# EAGLE schematic untitled (EAGLE 6.2)
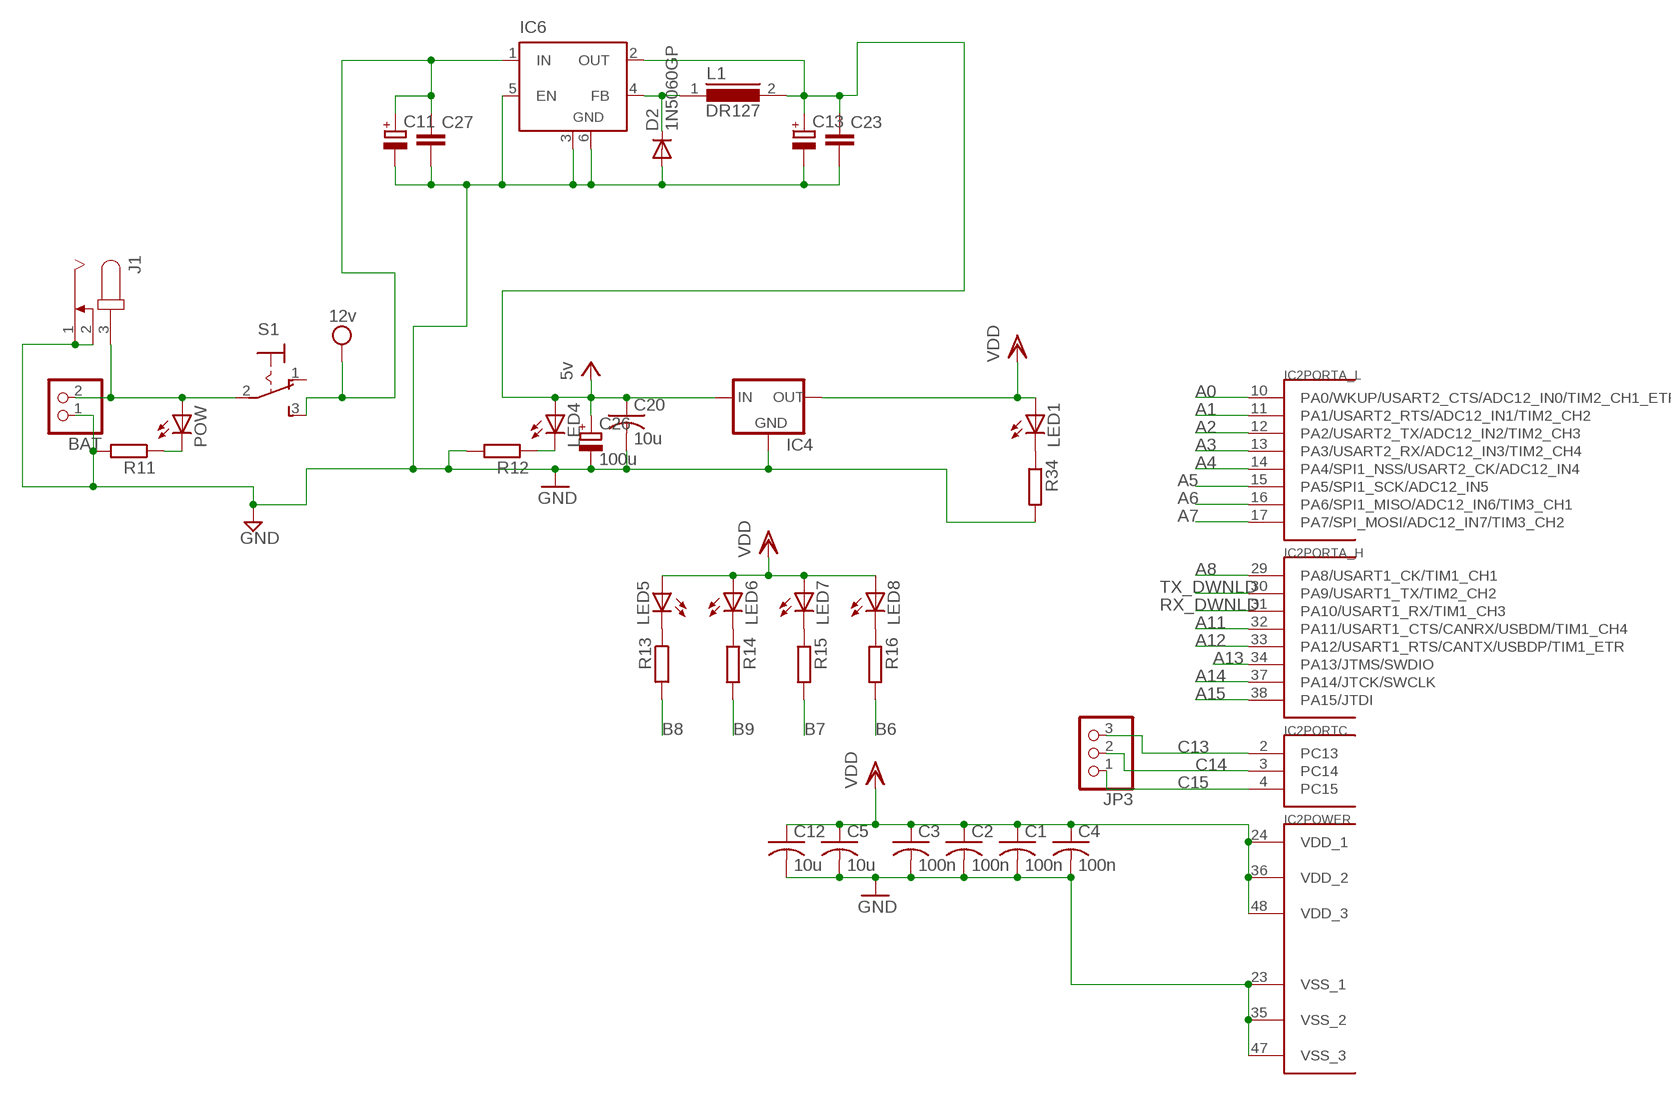
[diagram p0: schematic, sheet 1, part 1 of 2]
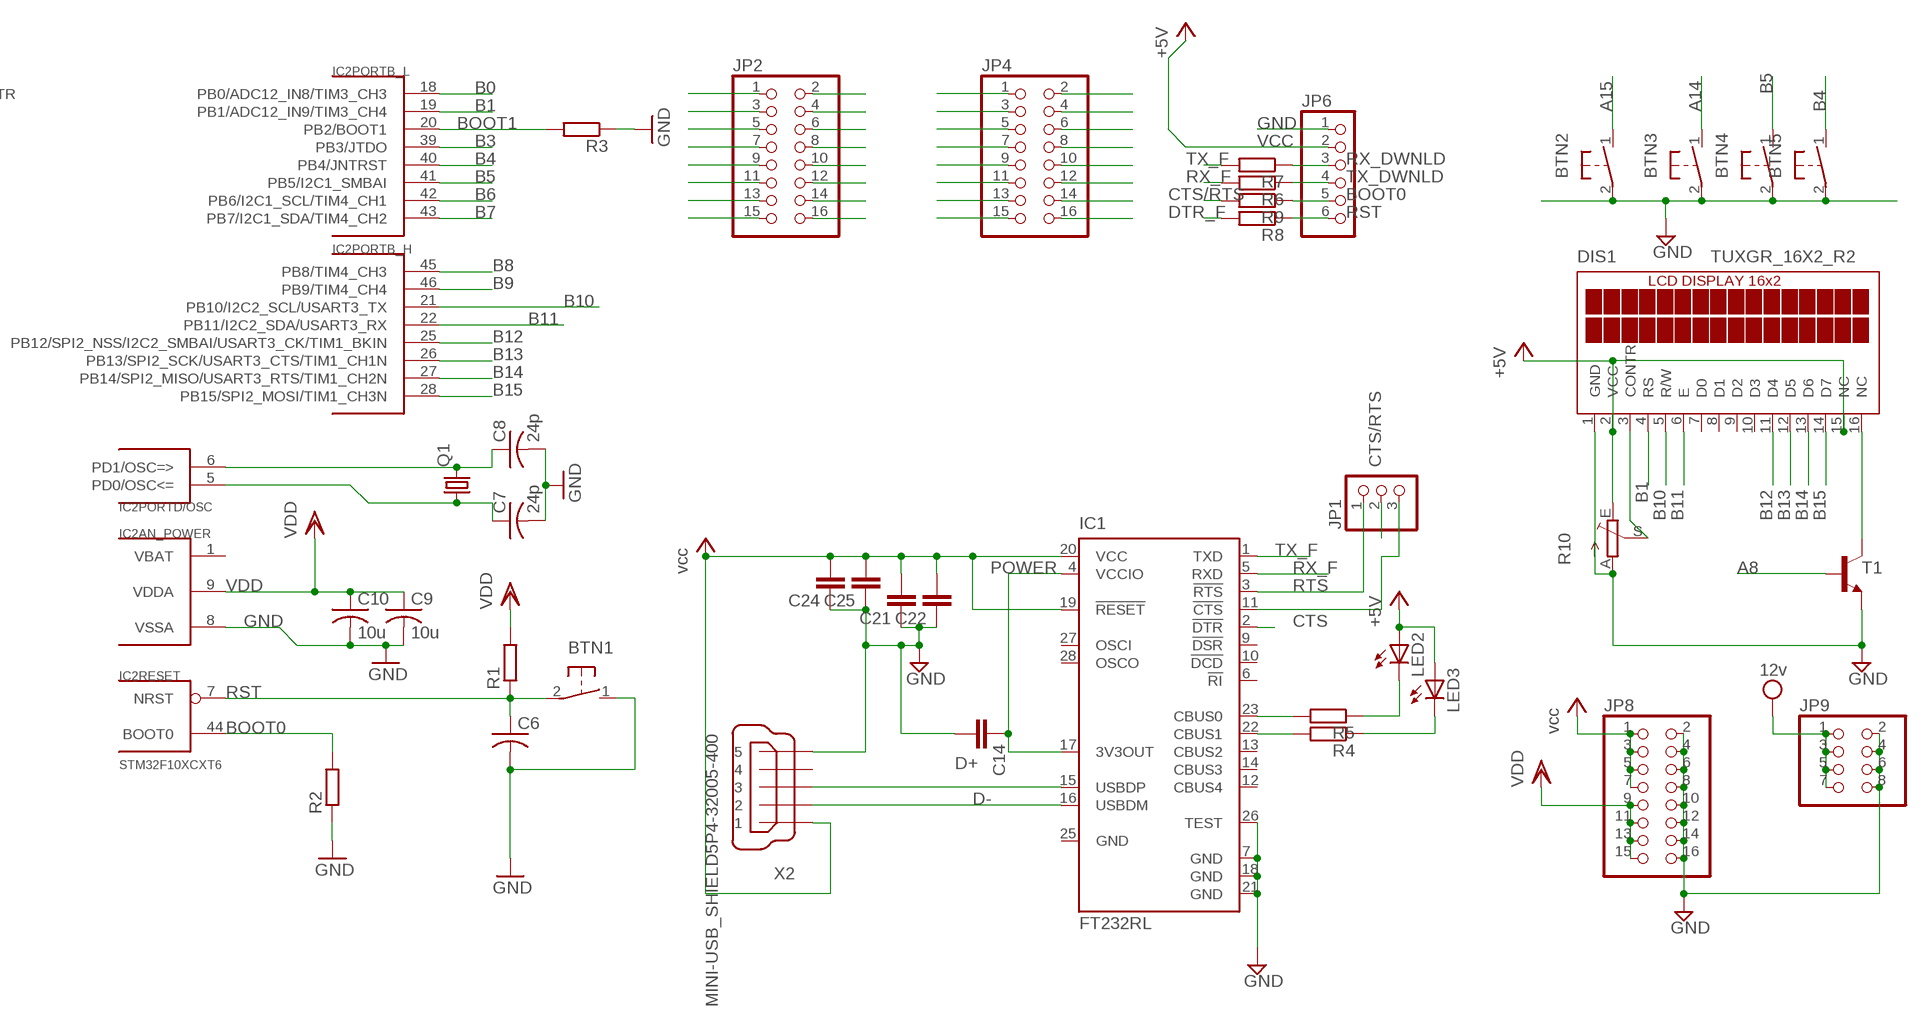
[diagram p1: schematic, sheet 1, part 2 of 2]

## Parts
BAT  PINHD-1X2  [1X02]
BTN1  PUSHBTN  [PUSHBUTTON]
BTN2  PUSHBTN  [PUSHBUTTON]
BTN3  PUSHBTN  [PUSHBUTTON]
BTN4  PUSHBTN  [PUSHBUTTON]
BTN5  PUSHBTN  [PUSHBUTTON]
C1  100n  C-USC0805  [C0805]
C2  100n  C-USC0805  [C0805]
C3  100n  C-USC0805  [C0805]
C4  100n  C-USC0805  [C0805]
C5  10u  C-USC0805  [C0805]
C6  C-USC0805  [C0805]
C7  24p  C-USC0805  [C0805]
C8  24p  C-USC0805  [C0805]
C9  10u  C-USC0805  [C0805]
C10  10u  C-USC0805  [C0805]
C11  CPOL-EU153CLV-1012  [153CLV-1012]
C12  10u  C-USC0805  [C0805]
C13  CPOL-EU153CLV-1012  [153CLV-1012]
C14  C-EUC0805  [C0805]
C20  10u  C-USC0805  [C0805]
C21  C-EUC0805  [C0805]
C22  C-EUC0805  [C0805]
C23  C-EUC0805  [C0805]
C24  C-EUC0805  [C0805]
C25  C-EUC0805  [C0805]
C26  100u  CPOL-EU153CLV-1012  [153CLV-1012]
C27  C-EUC0805  [C0805]
D2  1N5060GP  [DO15-12]
DIS1  TUXGR_16X2_R2  [TUXGR_16X2_R2]
IC1  FT232RL  [SSOP28]
IC2  STM32F10XCXT6  [TQFP48]
IC4  LM1117  [SOT223]
IC6  LM2596S  [TO263-5]
J1  JACK-PLUG1  [SPC4078]
JP1  PINHD-1X3  [1X03]
JP2  PINHD-2X8  [2X08]
JP3  PINHD-1X3  [1X03]
JP4  PINHD-2X8  [2X08]
JP6  PINHD-1X6  [1X06]
JP8  PINHD-2X8  [2X08]
JP9  PINHD-2X4  [2X04]
L1  DR127  [DR127]
LED1  LEDSMT1206  [1206]
LED2  LEDSMT1206  [1206]
LED3  LEDSMT1206  [1206]
LED4  LEDSMT1206  [1206]
LED5  LEDSMT1206  [1206]
LED6  LEDSMT1206  [1206]
LED7  LEDSMT1206  [1206]
LED8  LEDSMT1206  [1206]
POW  LEDSMT1206  [1206]
Q1  CRYSTALHC49U-V  [HC49U-V]
R1  R-EU_M0805  [M0805]
R2  R-EU_M0805  [M0805]
R3  R-EU_M0805  [M0805]
R4  R-EU_R0805  [R0805]
R5  R-EU_R0805  [R0805]
R6  R-EU_R0805  [R0805]
R7  R-EU_R0805  [R0805]
R8  R-EU_R0805  [R0805]
R9  R-EU_R0805  [R0805]
R10  TRIM_EU-CA6V  [CA6V]
R11  R-EU_M0805  [M0805]
R12  R-EU_M0805  [M0805]
R13  R-EU_M0805  [M0805]
R14  R-EU_M0805  [M0805]
R15  R-EU_M0805  [M0805]
R16  R-EU_M0805  [M0805]
R34  R-EU_M0805  [M0805]
S1  320-916  [320-916]
T1  BC818-NPN-SOT23-BEC  [SOT23-BEC]
X2  MINI-USB_SHIELD5P4-32005-400  [32005-400]

## Nets
12V: C11.+ C27.1 IC6.1(IN) JP9.1 JP9.3 JP9.5 JP9.7 S1.3(S) ; supply symbol labelled 12v
A0: IC2.10(PORTA_L:PA0/WKUP/USART2_CTS/ADC12_IN0/TIM2_CH1_ETR)
A1: IC2.11(PORTA_L:PA1/USART2_RTS/ADC12_IN1/TIM2_CH2)
A2: IC2.12(PORTA_L:PA2/USART2_TX/ADC12_IN2/TIM2_CH3)
A3: IC2.13(PORTA_L:PA3/USART2_RX/ADC12_IN3/TIM2_CH4)
A4: IC2.14(PORTA_L:PA4/SPI1_NSS/USART2_CK/ADC12_IN4)
A5: IC2.15(PORTA_L:PA5/SPI1_SCK/ADC12_IN5)
A6: IC2.16(PORTA_L:PA6/SPI1_MISO/ADC12_IN6/TIM3_CH1)
A7: IC2.17(PORTA_L:PA7/SPI_MOSI/ADC12_IN7/TIM3_CH2)
A8: IC2.29(PORTA_H:PA8/USART1_CK/TIM1_CH1) T1.B
A11: IC2.32(PORTA_H:PA11/USART1_CTS/CANRX/USBDM/TIM1_CH4)
A12: IC2.33(PORTA_H:PA12/USART1_RTS/CANTX/USBDP/TIM1_ETR)
A13: IC2.34(PORTA_H:PA13/JTMS/SWDIO)
A14: BTN3.1 IC2.37(PORTA_H:PA14/JTCK/SWCLK)
A15: BTN2.1 IC2.38(PORTA_H:PA15/JTDI)
B0: IC2.18(PORTB_L:PB0/ADC12_IN8/TIM3_CH3)
B1: DIS1.4(RS) IC2.19(PORTB_L:PB1/ADC12_IN9/TIM3_CH4)
B3: IC2.39(PORTB_L:PB3/JTDO)
B4: BTN5.1 IC2.40(PORTB_L:PB4/JNTRST)
B5: BTN4.1 IC2.41(PORTB_L:PB5/I2C1_SMBAI)
B6: IC2.42(PORTB_L:PB6/I2C1_SCL/TIM4_CH1) R16.2
B7: IC2.43(PORTB_L:PB7/I2C1_SDA/TIM4_CH2) R15.2
B8: IC2.45(PORTB_H:PB8/TIM4_CH3) R13.2
B9: IC2.46(PORTB_H:PB9/TIM4_CH4) R14.2
B10: DIS1.5(R/W) IC2.21(PORTB_H:PB10/I2C2_SCL/USART3_TX)
B11: DIS1.6(E) IC2.22(PORTB_H:PB11/I2C2_SDA/USART3_RX)
B12: DIS1.11(D4) IC2.25(PORTB_H:PB12/SPI2_NSS/I2C2_SMBAI/USART3_CK/TIM1_BKIN)
B13: DIS1.12(D5) IC2.26(PORTB_H:PB13/SPI2_SCK/USART3_CTS/TIM1_CH1N)
B14: DIS1.13(D6) IC2.27(PORTB_H:PB14/SPI2_MISO/USART3_RTS/TIM1_CH2N)
B15: DIS1.14(D7) IC2.28(PORTB_H:PB15/SPI2_MOSI/TIM1_CH3N)
BOOT0: IC2.44(RESET:BOOT0) JP6.5 R2.2 R9.1
BOOT1: IC2.20(PORTB_L:PB2/BOOT1) R3.2
C13: IC2.2(PORTC:PC13) JP3.3
C14: IC2.3(PORTC:PC14) JP3.2
C15: IC2.4(PORTC:PC15) JP3.1
CTS: IC1.11(!CTS) JP1.3
CTS/RTS: JP1.2 R9.2
D+: IC1.15(USBDP) X2.3
D-: IC1.16(USBDM) X2.2
DTR_F: IC1.2(!DTR) R8.2
GND: BAT.1 BTN1.1 BTN2.2 BTN3.2 BTN4.2 BTN5.2 C1.2 C2.2 C3.2 C4.2 C5.2 C6.2 C7.2 C8.2 C9.2 C10.2 C11.- C12.2 C13.- C14.2 C20.2 C21.1 C22.1 C23.2 C24.1 C25.1 C26.- C27.2 D2.A DIS1.1(GND) IC1.7(GND) IC1.18(GND) IC1.21(GND) IC1.26(TEST) IC2.8(AN_POWER:VSSA) IC2.23(POWER:VSS_1) IC2.35(POWER:VSS_2) IC2.47(POWER:VSS_3) IC4.1(GND) IC6.3(GND) IC6.5(EN) IC6.6(GND) J1.1 J1.2 JP6.1 JP8.2 JP8.4 JP8.6 JP8.8 JP8.10 JP8.12 JP8.14 JP8.16 JP9.2 JP9.4 JP9.6 JP9.8 R2.1 R3.1 R10.A R11.2 R12.2 R34.2 T1.E X2.5
N$1: LED2.C R5.1
N$2: LED3.C R4.1
N$3: BAT.2 J1.3 POW.A S1.2(P)
N$4: IC1.23(CBUS0) R5.2
N$5: IC1.22(CBUS1) R4.2
N$6: LED4.C R12.1
N$7: DIS1.3(CONTR) R10.S
N$8: LED5.C R13.1
N$9: LED6.C R14.1
N$10: LED7.C R15.1
N$11: LED8.C R16.1
N$15: DIS1.16(NC) T1.C
N$17: D2.C IC6.4(FB) L1.1
N$20: POW.C R11.1
N$38: JP2.1
N$39: JP2.3
N$40: JP2.5
N$41: JP2.7
N$42: JP2.9
N$43: JP2.11
N$44: JP2.13
N$45: JP2.15
N$54: JP2.2
N$55: JP2.4
N$56: JP2.6
N$57: JP2.8
N$58: JP2.10
N$59: JP2.12
N$60: JP2.14
N$61: JP2.16
N$70: JP4.1
N$71: JP4.3
N$72: JP4.5
N$73: JP4.7
N$74: JP4.9
N$75: JP4.11
N$76: JP4.13
N$77: JP4.15
N$78: JP4.2
N$79: JP4.4
N$81: JP4.8
N$82: JP4.10
N$83: JP4.12
N$84: JP4.14
N$85: JP4.16
N$86: LED1.C R34.1
N$87: JP4.6
OSC_IN: C7.1 IC2.5(PORTD/OSC:PD0/OSC<=) Q1.1
OSC_OUT: C8.1 IC2.6(PORTD/OSC:PD1/OSC=>) Q1.2
POWER: C14.1 IC1.4(VCCIO) IC1.17(3V3OUT)
RST: BTN1.2 C6.1 IC2.7(RESET:NRST) JP6.6 R1.1 R8.1
RTS: IC1.3(!RTS) JP1.1
RX_DWNLD: IC2.31(PORTA_H:PA10/USART1_RX/TIM1_CH3) JP6.3 R7.1
RX_F: IC1.5(RXD) R6.2
TX_DWNLD: IC2.30(PORTA_H:PA9/USART1_TX/TIM2_CH2) JP6.4 R6.1
TX_F: IC1.1(TXD) R7.2
VCC: C13.+ C20.1 C21.2 C22.2 C23.1 C24.2 C25.2 C26.+ IC1.19(!RESET) IC1.20(VCC) IC4.3(IN) IC6.2(OUT) JP6.2 JP8.1 JP8.3 JP8.5 JP8.7 L1.2 LED2.A LED3.A LED4.A X2.1 ; supply symbol labelled 5v, vcc, +5V
VDD: C1.1 C2.1 C3.1 C4.1 C5.1 C9.1 C10.1 C12.1 DIS1.2(VCC) DIS1.15(NC) IC2.9(AN_POWER:VDDA) IC2.24(POWER:VDD_1) IC2.36(POWER:VDD_2) IC2.48(POWER:VDD_3) IC4.2(OUT) JP8.9 JP8.11 JP8.13 JP8.15 LED1.A LED5.A LED6.A LED7.A LED8.A R1.2 R10.E ; supply symbol labelled +5V
Unconnected: DIS1.7(D0) DIS1.8(D1) DIS1.9(D2) DIS1.10(D3) IC1.6(!RI) IC1.9(!DSR) IC1.10(!DCD) IC1.12(CBUS4) IC1.13(CBUS2) IC1.14(CBUS3) IC1.27(OSCI) IC1.28(OSCO) S1.1(O) X2.4 X2.M1(S1) X2.M2(S2) X2.M3(S3) X2.M4(S4)

## Power pins joined to a net without a drawn wire
GND: IC1.25(GND)
VBAT: IC2.1(AN_POWER:VBAT)

## Library data of the parts
BAT = pinhead:PINHD-1X2: PIN HEADER
BTN1-BTN5 = switch-omron:PUSHBTN
C1-C10 C12 C20 = rcl:C-US: CAPACITOR, American symbol
C11 C13 C26 = rcl:CPOL-EU: POLARIZED CAPACITOR, European symbol
C14 C21-C25 C27 = rcl:C-EU: CAPACITOR, European symbol
D2 = diode:1N5060GP: DIODE controlled avalanche rectifier
DIS1 = display-lcd:TUXGR_16X2_R2: Tuxgraphics LCD display 16x2 characters reflective, without background light Source: tuxgr_12x2_r2.pdf; OC_FARNELL: unknown; OC_NEWARK: unknown
IC1 = ftdichip:FT232R: Source: http://www.ftdichip.com/Documents/DataSheets/DS_FT232R_v104.pdf; MPN: FT232RL; OC_FARNELL: 1146032; OC_NEWARK: 91K9918
IC2 = stm32:STM32F10XCXT6: ST STM32F101/103 48pin LQFP
IC4 = v-reg-3:LM1117
IC6 = linear:LM2596S: STEP-DOWN VOLTAGE REGULATOR
J1 = con-jack:JACK-PLUG: DC POWER JACK Power Jack, DC, Right Angle, Through Hole, Rated 5A at 16VDC, PC Terminals Distributor: Farnell (www.Farnell.de) Drawing: 84N1161.pdf / 84N1162.pdf Manufacturer: SPC Technology (www.spctechnology.com) Type: SPC4077 / SPC 4078; OC_FARNELL: unknown; OC_NEWARK: unknown
JP1 JP3 = pinhead:PINHD-1X3: PIN HEADER
JP2 JP4 JP8 = pinhead:PINHD-2X8: PIN HEADER
JP6 = pinhead:PINHD-1X6: PIN HEADER
JP9 = pinhead:PINHD-2X4: PIN HEADER
L1 = inductors:DR127: High Power Density, High Efficiency, Shielded Inductors Source: coiltronics_dr_series.pdf
LED1-LED8 POW = led:LED: LED OSRAM: - CHIPLED LG R971, LG N971, LY N971, LG Q971, LY Q971, LO R971, LY R971 LH N974, LH R974 LS Q976, LO Q976, LY Q976 LO Q996 - Hyper CHIPLED LW Q18S LB Q993, LB Q99A, LB R99A - SideLED LS A670, LO A670, LY A670, LG A670, LP A670 LB A673, LV A673, LT A673, LW A673 LH A674 LY A675 LS A676, LA A676, LO A676, LY A676, LW A676 LS A679, LY A679, LG A679 - Hyper Micro SIDELED® LS Y876, LA Y876, LO Y876, LY Y876 LT Y87S - SmartLED LW L88C, LW L88S LB L89C, LB L89S, LG L890 LS L89K, LO L89K, LY L89K LS L896, LA L896, LO L896, LY L896 - TOPLED LS T670, LO T670, LY T670, LG T670, LP T670 LSG T670, LSP T670, LSY T670, LOP T670, LYG T670 LG T671, LOG T671, LSG T671 LB T673, LV T673, LT T673, LW T673 LH T674 LS T676, LA T676, LO T676, LY T676, LB T676, LH T676, LSB T676, LW T676 LB T67C, LV T67C, LT T67C, LS T67K, LO T67K, LY T67K, LW E67C LS E67B, LA E67B, LO E67B, LY E67B, LB E67C, LV E67C, LT E67C LW T67C LS T679, LY T679, LG T679 LS T770, LO T770, LY T770, LG T770, LP T770 LB T773, LV T773, LT T773, LW T773 LH T774 LS E675, LA E675, LY E675, LS T675 LS T776, LA T776, LO T776, LY T776, LB T776 LHGB T686 LT T68C, LB T68C - Hyper Mini TOPLED® LB M676 - Mini TOPLED Santana® LG M470 LS M47K, LO M47K, LY M47K Source: http://www.osram.convergy.de LUXEON: - LUMILED® LXK2-PW12-R00, LXK2-PW12-S00, LXK2-PW14-U00, LXK2-PW14-V00 LXK2-PM12-R00, LXK2-PM12-S00, LXK2-PM14-U00 LXK2-PE12-Q00, LXK2-PE12-R00, LXK2-PE12-S00, LXK2-PE14-T00, LXK2-PE14-U00 LXK2-PB12-K00, LXK2-PB12-L00, LXK2-PB12-M00, LXK2-PB14-N00, LXK2-PB14-P00, LXK2-PB14-Q00 LXK2-PR12-L00, LXK2-PR12-M00, LXK2-PR14-Q00, LXK2-PR14-R00 LXK2-PD12-Q00, LXK2-PD12-R00, LXK2-PD12-S00 LXK2-PH12-R00, LXK2-PH12-S00 LXK2-PL12-P00, LXK2-PL12-Q00, LXK2-PL12-R00 Source: www.luxeon.com KINGBRIGHT: KA-3528ASYC Source: www.kingbright.com
Q1 = crystal:CRYSTAL: CRYSTAL; OC_FARNELL: 1666969; OC_NEWARK: unknown
R1-R9 R11-R16 R34 = rcl:R-EU_: RESISTOR, European symbol
R10 = pot:TRIM_EU-: POTENTIOMETER
S1 = switch:320-916: TOGGLE SWITCH distributor RS Components
T1 = transistor:*-NPN-: NPN Transistror BF959 corrected 2008.03.06
X2 = con-cypressindustries:MINI-USB_SHIELD5P4-: MINI USB-B R/A W/O POST 5 pol. Source: www.cypressindustries.com; OC_FARNELL: unknown; OC_NEWARK: unknown